# EAGLE design motor control (EAGLE 7.1.0)
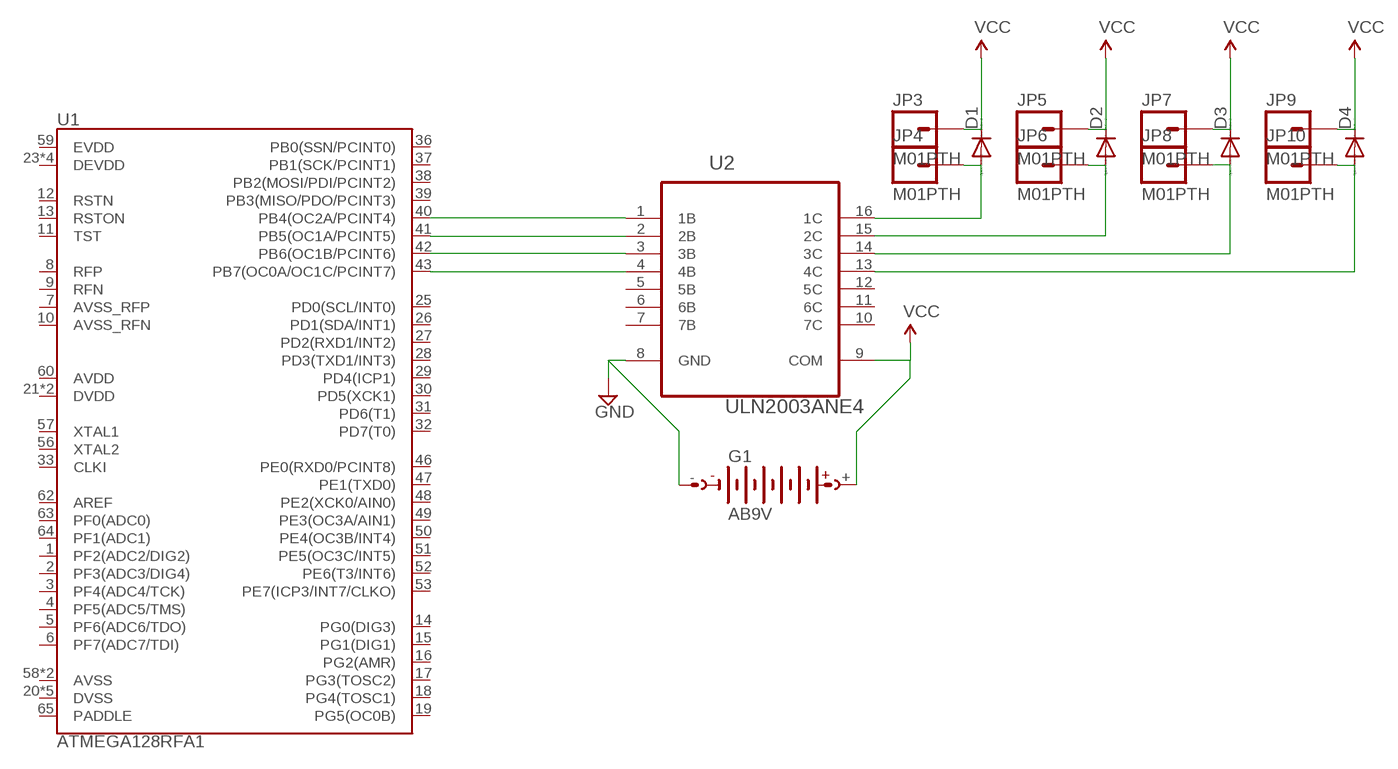
[diagram p0: schematic, sheet 1]

## Parts
D1  DIODE-D-5  [D-5]
D2  DIODE-D-5  [D-5]
D3  DIODE-D-5  [D-5]
D4  DIODE-D-5  [D-5]
G1  AB9V  [AB9V]
JP3  M01PTH  [1X01]
JP4  M01PTH  [1X01]
JP5  M01PTH  [1X01]
JP6  M01PTH  [1X01]
JP7  M01PTH  [1X01]
JP8  M01PTH  [1X01]
JP9  M01PTH  [1X01]
JP10  M01PTH  [1X01]
U1  ATMEGA128RFA1  [QFN-64]
U2  ULN2003ANE4  [DIP254P762X508-16]

## Nets
GND: G1.- U2.8(GND)
N$1: U1.40(PB4(OC2A/PCINT4)) U2.1(1B)
N$2: U1.41(PB5(OC1A/PCINT5)) U2.2(2B)
N$3: U1.42(PB6(OC1B/PCINT6)) U2.3(3B)
N$4: U1.43(PB7(OC0A/OC1C/PCINT7)) U2.4(4B)
N$5: D1.A JP4.1 U2.16(1C)
N$14: D4.A JP10.1 U2.13(4C)
N$15: D3.A JP8.1 U2.14(3C)
N$16: D2.A JP6.1 U2.15(2C)
VCC: D1.C D2.C D3.C D4.C G1.+ JP3.1 JP5.1 JP7.1 JP9.1 U2.9(COM)
Unconnected: U1.1(PF2(ADC2/DIG2)) U1.2(PF3(ADC3/DIG4)) U1.3(PF4(ADC4/TCK)) U1.4(PF5(ADC5/TMS)) U1.5(PF6(ADC6/TDO)) U1.6(PF7(ADC7/TDI)) U1.7(AVSS_RFP) U1.8(RFP) U1.9(RFN) U1.10(AVSS_RFN) U1.11(TST) U1.12(RSTN) U1.13(RSTON) U1.14(PG0(DIG3)) U1.15(PG1(DIG1)) U1.16(PG2(AMR)) U1.17(PG3(TOSC2)) U1.18(PG4(TOSC1)) U1.19(PG5(OC0B)) U1.20(DVSS) U1.21(DVDD) U1.22(DVDD) U1.23(DEVDD) U1.24(DVSS) U1.25(PD0(SCL/INT0)) U1.26(PD1(SDA/INT1)) U1.27(PD2(RXD1/INT2)) U1.28(PD3(TXD1/INT3)) U1.29(PD4(ICP1)) U1.30(PD5(XCK1)) U1.31(PD6(T1)) U1.32(PD7(T0)) U1.33(CLKI) U1.34(DEVDD) U1.35(DVSS) U1.36(PB0(SSN/PCINT0)) U1.37(PB1(SCK/PCINT1)) U1.38(PB2(MOSI/PDI/PCINT2)) U1.39(PB3(MISO/PDO/PCINT3)) U1.44(DEVDD) U1.45(DVSS) U1.46(PE0(RXD0/PCINT8)) U1.47(PE1(TXD0)) U1.48(PE2(XCK0/AIN0)) U1.49(PE3(OC3A/AIN1)) U1.50(PE4(OC3B/INT4)) U1.51(PE5(OC3C/INT5)) U1.52(PE6(T3/INT6)) U1.53(PE7(ICP3/INT7/CLKO)) U1.54(DEVDD) U1.55(DVSS) U1.56(XTAL2) U1.57(XTAL1) U1.58(AVSS) U1.59(EVDD) U1.60(AVDD) U1.61(AVSS) U1.62(AREF) U1.63(PF0(ADC0)) U1.64(PF1(ADC1)) U1.65(PADDLE) U2.5(5B) U2.6(6B) U2.7(7B) U2.10(7C) U2.11(6C) U2.12(5C)

## Library data of the parts
D1-D4 = diode:DIODE-: DIODE
G1 = battery:AB9V: 9-V BATTERY CLIP
JP3-JP10 = SparkFun:M01: Header 1 Standard 1-pin 0.1" header. Use with straight break away headers (SKU : PRT-00116), right angle break away headers (PRT-00553), swiss pins (PRT-00743), machine pins (PRT-00117), and female headers (PRT-00115).
U1 = ATmega128RFA1-DevBoard:ATMEGA128RFA1: ATmega128RFA1 8-bit AVR Microcontroller with Low Power 2.4GHz Transceiver for ZigBee and IEEE 802.15.4
U2 = Texas Instruments_By_element14_Batch_1:ULN2003ANE4: HIGH-VOLTAGE, HIGH-CURRENT DARLINGTON TRANSISTOR ARRAYS; MPN: ULN2003ANE4; OC_FARNELL: 1210973; OC_NEWARK: 98K2130; PACKAGE: PDIP-16; SUPPLIER: Texas Instruments

## Board
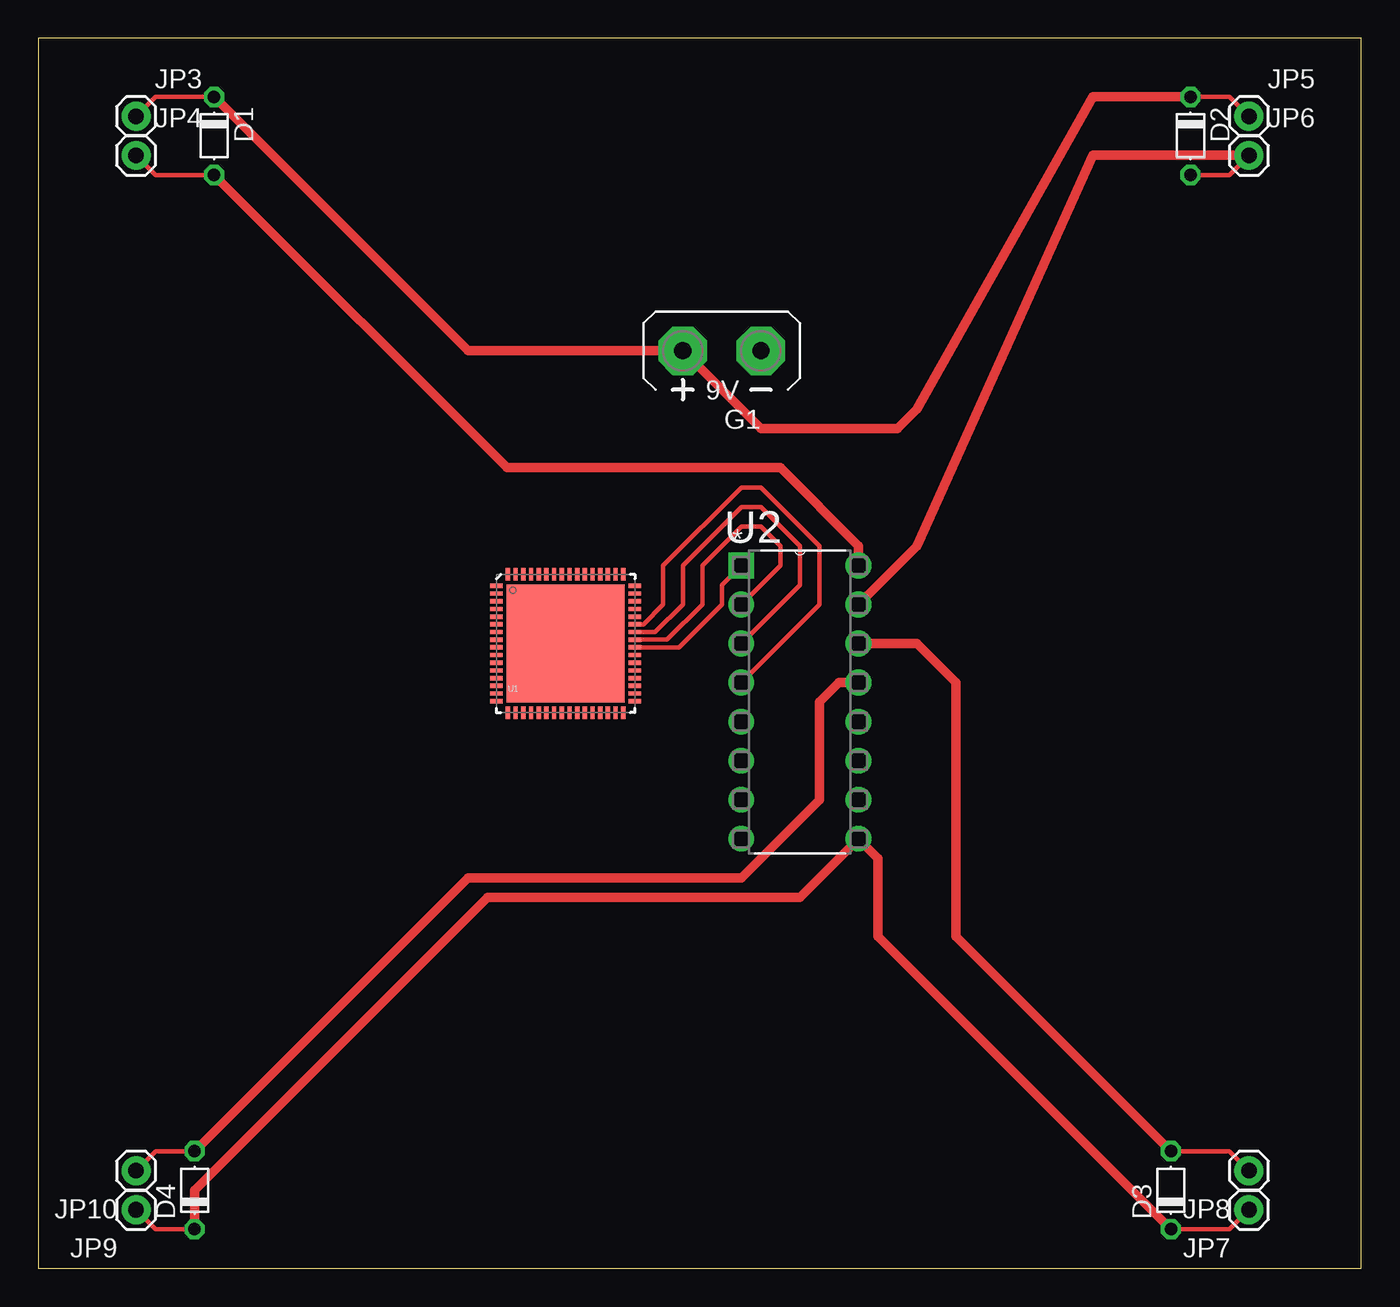
[diagram p1: board, top side]
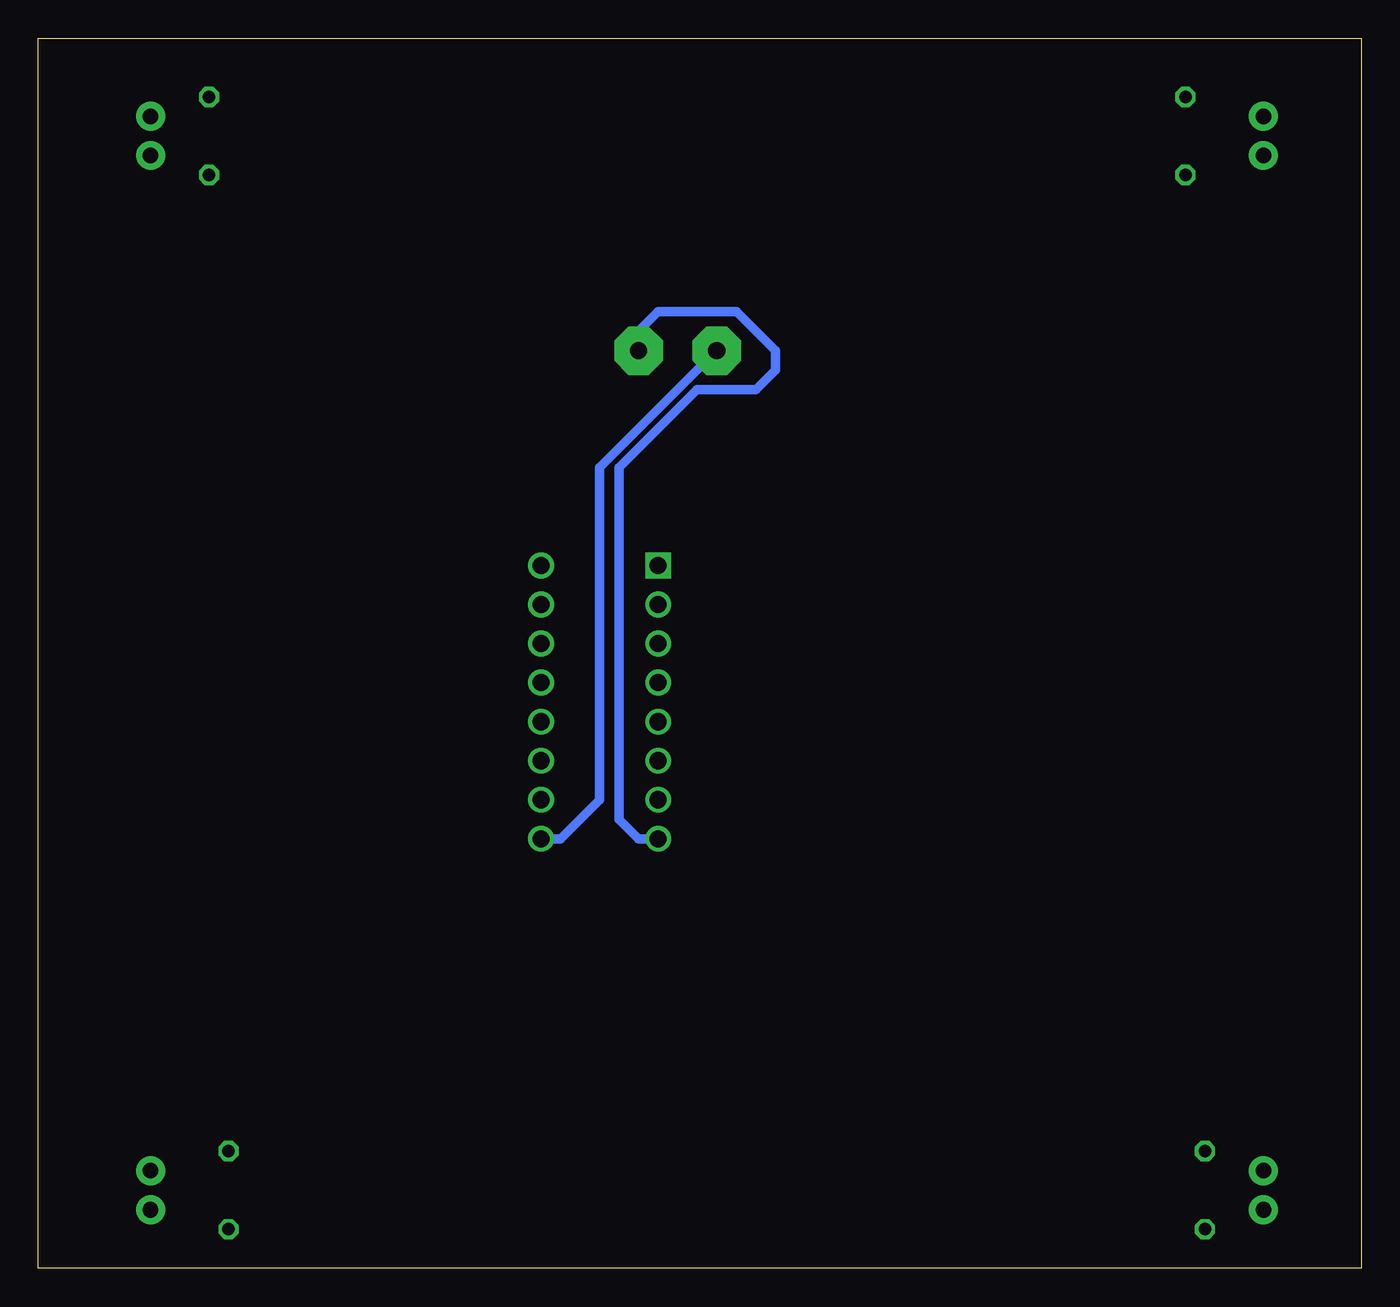
[diagram p2: board, bottom side, seen from below]

Size 86.03 x 80 mm. Coordinates in mm from the lower left corner, seen from the top.
Outline: 0,0 86.03,0 86.03,80 0,80 0,0
Copper layers (1*16): Top 0.035mm / dielectric 1.5mm / Bottom 0.035mm
Design rules "default": minimum track width 10mil, minimum drill 24mil, track to track 8mil, track to pad 8mil, pad to pad 8mil, via to via 8mil, smd to smd 8mil, copper to edge 40mil, drill to drill 8mil, minimum pad ring 10mil, minimum via ring 8mil, stop-mask expansion 4mil, vias tented up to drill 0mil, thermal gap 10mil

### Footprints (pad centres in the part's own frame; a part is rotated, then mirrored left to right if it is on the bottom)
D-5 = drill 0.813 octagon: A 2.54,0; C -2.54,0
AB9V = drill 1.118 pad 3.15 octagon: + 0,2.54; - 0,-2.54
1X01 = drill 1.016 pad 1.88: 1 0,0
QFN-64 = smd 0.8 x 0.28: 1 -4.5,3.75; 2 -4.5,3.25; 3 -4.5,2.75; 4 -4.5,2.25; 5 -4.5,1.75; 6 -4.5,1.25; 7 -4.5,0.75; 8 -4.5,0.25; 9 -4.5,-0.25; 10 -4.5,-0.75; 11 -4.5,-1.25; 12 -4.5,-1.75; 13 -4.5,-2.25; 14 -4.5,-2.75; 15 -4.5,-3.25; 16 -4.5,-3.75; 33 4.5,-3.75; 34 4.5,-3.25; 35 4.5,-2.75; 36 4.5,-2.25; 37 4.5,-1.75; 38 4.5,-1.25; 39 4.5,-0.75; 40 4.5,-0.25; 41 4.5,0.25; 42 4.5,0.75; 43 4.5,1.25; 44 4.5,1.75; 45 4.5,2.25; 46 4.5,2.75; 47 4.5,3.25; 48 4.5,3.75 | smd 0.28 x 0.8: 17 -3.75,-4.5; 18 -3.25,-4.5; 19 -2.75,-4.5; 20 -2.25,-4.5; 21 -1.75,-4.5; 22 -1.25,-4.5; 23 -0.75,-4.5; 24 -0.25,-4.5; 25 0.25,-4.5; 26 0.75,-4.5; 27 1.25,-4.5; 28 1.75,-4.5; 29 2.25,-4.5; 30 2.75,-4.5; 31 3.25,-4.5; 32 3.75,-4.5; 49 3.75,4.5; 50 3.25,4.5; 51 2.75,4.5; 52 2.25,4.5; 53 1.75,4.5; 54 1.25,4.5; 55 0.75,4.5; 56 0.25,4.5; 57 -0.25,4.5; 58 -0.75,4.5; 59 -1.25,4.5; 60 -1.75,4.5; 61 -2.25,4.5; 62 -2.75,4.5; 63 -3.25,4.5; 64 -3.75,4.5 | smd 7.65 x 7.65: 65 0,0
DIP254P762X508-16 = drill 1.118 square: 1 -7.62,17.78 | drill 1.118: 2 -7.62,15.24; 3 -7.62,12.7; 4 -7.62,10.16; 5 -7.62,7.62; 6 -7.62,5.08; 7 -7.62,2.54; 8 -7.62,0; 9 0,0; 10 0,2.54; 11 0,5.08; 12 0,7.62; 13 0,10.16; 14 0,12.7; 15 0,15.24; 16 0,17.78

### Placement (x,y rotation side)
D1  11.43,73.66 270 top
D2  74.93,73.66 270 top
D3  73.66,5.08 90 top
D4  10.16,5.08 90 top
G1  44.45,59.69 90 top
JP3  6.35,74.93 0 top
JP4  6.35,72.39 0 top
JP5  78.74,74.93 0 top
JP6  78.74,72.39 0 top
JP7  78.74,3.81 180 top
JP8  78.74,6.35 180 top
JP9  6.35,3.81 180 top
JP10  6.35,6.35 180 top
U1  34.29,40.64 0 top
U2  53.34,27.94 0 top

### Tracks (layer width: path | path; a pad name or v marks a point on that pad's centre or on a via)
GND
  Bottom 0.61: G1.- 46.99,60.96 45.72,62.23 40.64,62.23 38.1,59.69 38.1,58.42 39.37,57.15 43.18,57.15 48.26,52.07 48.26,29.21 46.99,27.94 U2.8
N$1
  Top 0.305: U2.1 44.45,44.45 44.45,43.18 41.66,40.39 U1.40
N$2
  Top 0.305: U2.2 46.99,44.45 48.26,45.72 48.26,46.99 46.99,48.26 45.72,48.26 43.18,45.72 43.18,43.18 40.89,40.89 U1.41
N$3
  Top 0.305: U2.3 49.53,44.45 49.53,46.99 46.99,49.53 45.72,49.53 41.91,45.72 41.91,43.18 40.12,41.39 U1.42
N$4
  Top 0.305: U2.4 50.8,43.18 50.8,46.99 46.99,50.8 45.72,50.8 40.64,45.72 40.64,43.18 39.35,41.89 U1.43
N$5
  Top 0.305: JP4.1 7.62,71.12 D1.A
  Top 0.61: U2.16 53.34,46.99 48.26,52.07 30.48,52.07 D1.A
N$14
  Top 0.305: D4.A 7.62,7.62 JP10.1
  Top 0.61: U2.13 52.07,38.1 50.8,36.83 50.8,30.48 45.72,25.4 27.94,25.4 D4.A
N$15
  Top 0.305: JP8.1 77.47,7.62 D3.A
  Top 0.61: U2.14 57.15,40.64 59.69,38.1 59.69,21.59 D3.A
N$16
  Top 0.305: D2.A 77.47,71.12 JP6.1
  Top 0.61: JP6.1 68.58,72.39 57.15,46.99 U2.15
VCC
  Top 0.305: JP9.1 7.62,2.54 D4.C | JP7.1 77.47,2.54 D3.C | JP5.1 77.47,76.2 D2.C | JP3.1 7.62,76.2 D1.C
  Top 0.61: D4.C 10.16,5.08 29.21,24.13 49.53,24.13 U2.9 54.61,26.67 54.61,21.59 D3.C | D1.C 27.94,59.69 G1.+ 46.99,54.61 55.88,54.61 57.15,55.88 68.58,76.2 D2.C
  Bottom 0.61: U2.9 52.07,27.94 49.53,30.48 49.53,52.07 G1.+